# Altium schematic sheet DASH.SchDoc
size A4
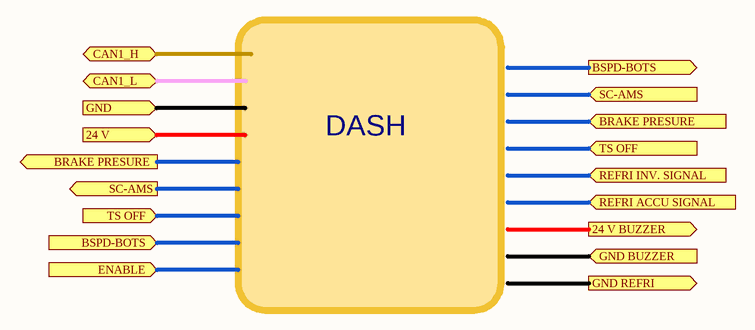
[diagram p0: DASH.SchDoc]

## Ports
24 V (in), 24 V BUZZER (out), BRAKE PRESURE  (in), BRAKE PRESURE  (out), BSPD-BOTS (in), BSPD-BOTS (out), CAN1_H (bidir), CAN1_L (bidir), ENABLE (in), GND (in), GND BUZZER (in), GND REFRI (out), REFRI ACCU SIGNAL (in), REFRI INV. SIGNAL (in), SC-AMS (in), SC-AMS (out), TS OFF (in)

## Notes on the sheet
- DASH